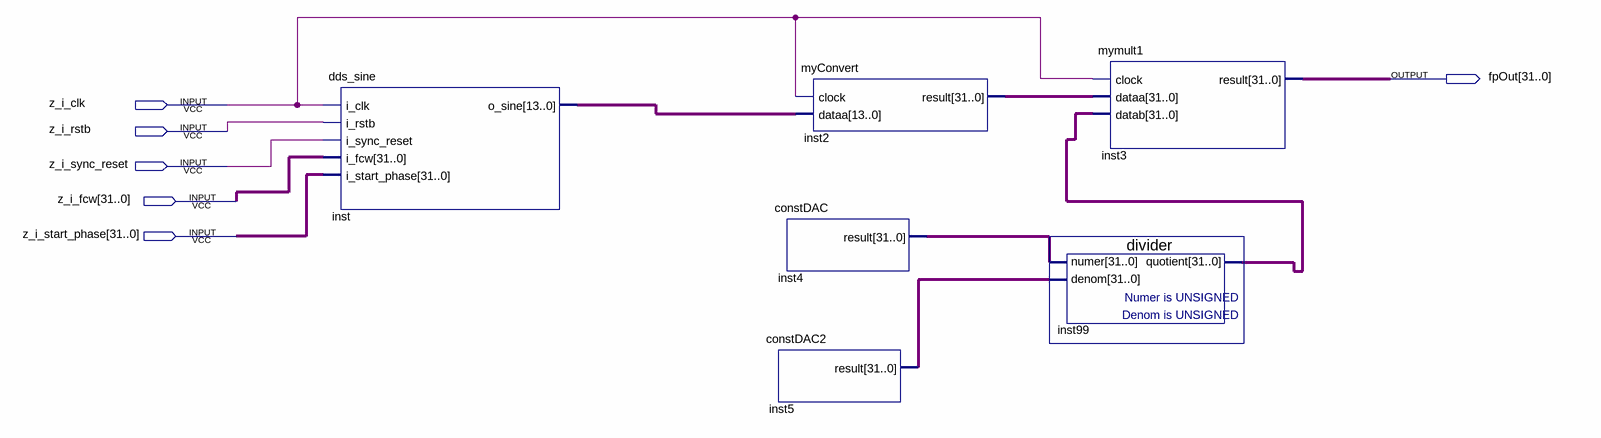
[diagram p0: schematic sheet]
// Quartus schematic fpdds.bdf as structural Verilog: 6 symbols, 6 pins
module fpdds (
  input  z_i_clk,
  input  z_i_rstb,
  input  z_i_sync_reset,
  input  [31:0] z_i_fcw,
  input  [31:0] z_i_start_phase,
  output [31:0] fpOut
);

  wire [13:0] inst_o_sine;
  wire [31:0] inst2_result, inst4_result, inst5_result, inst99_quotient;

  dds_sine inst (
    .i_clk(z_i_clk), .i_rstb(z_i_rstb), .i_sync_reset(z_i_sync_reset), .i_fcw(z_i_fcw),
    .i_start_phase(z_i_start_phase), .o_sine(inst_o_sine));
  myConvert inst2 (.clock(z_i_clk), .dataa(inst_o_sine), .result(inst2_result));
  constDAC inst4 (.result(inst4_result));
  constDAC2 inst5 (.result(inst5_result));
  divider inst99 (.denom(inst5_result), .numer(inst4_result), .quotient(inst99_quotient));
  mymult1 inst3 (.clock(z_i_clk), .dataa(inst2_result), .datab(inst99_quotient), .result(fpOut));
endmodule
